# Altium schematic sheet Micro Controller.SchDoc
size A4; SheetNumber: 4; SheetTotal: 6; ProjectTitle: DSP_VERSION_1.0
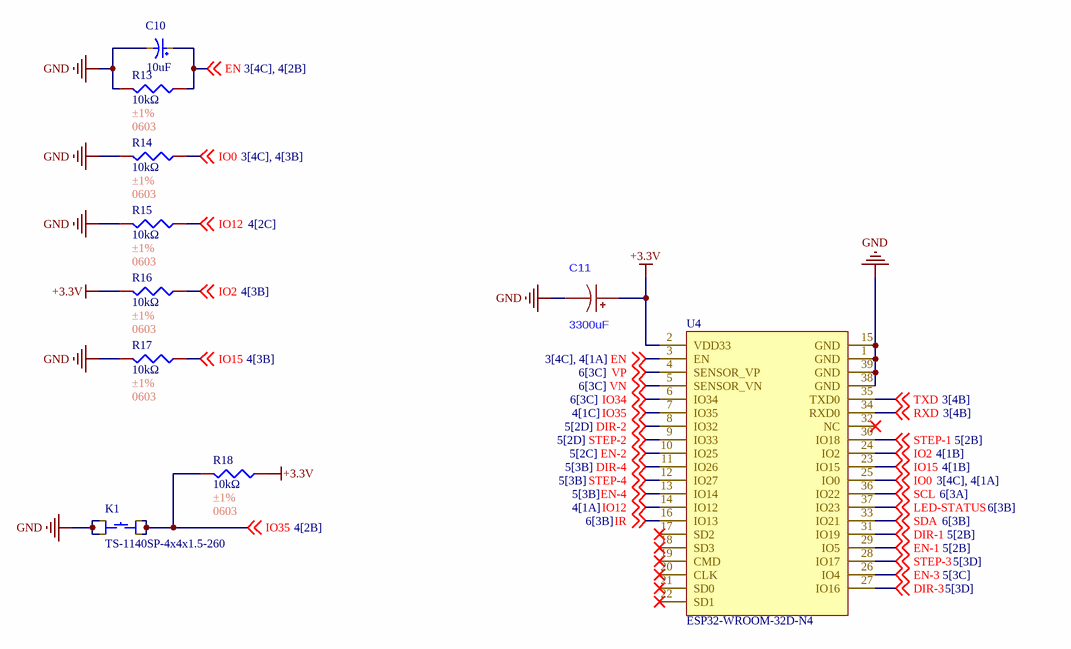
[diagram p0: Micro Controller.SchDoc]

## Parts
C10  10uF  [C_TH_5x11mm]
C11  3300uF  [Through Hole,D8xL16mm]
K1  TS-1140SP-4x4x1.5-260  [4x4x1.5]
R13  10kΩ  Tolerance: ±1%  Package: 0603  [R0603]
R14  10kΩ  Tolerance: ±1%  Package: 0603  [R0603]
R15  10kΩ  Tolerance: ±1%  Package: 0603  [R0603]
R16  10kΩ  Tolerance: ±1%  Package: 0603  [R0603]
R17  10kΩ  Tolerance: ±1%  Package: 0603  [R0603]
R18  10kΩ  Tolerance: ±1%  Package: 0603  [R0603]
U4  ESP32-WROOM-32D-N4  [ESP32-WROOM-32D-N4]

## Nets
+3.3V: C11.1 R16.2 R18.1 U4.2(VDD33)
GND: C10.2 C11.2 K1.1 K1.3 R13.2 R14.2 R15.2 R17.2 U4.1(GND) U4.15(GND) U4.38(GND) U4.39(GND)
DIR-1: U4.31(IO19) ; off-sheet DIR-1
DIR-2: U4.8(IO32) ; off-sheet DIR-2
DIR-3: U4.27(IO16) ; off-sheet DIR-3
DIR-4: U4.11(IO26) ; off-sheet DIR-4
EN: C10.1 R13.1 U4.3(EN) ; off-sheet EN
EN-1: U4.29(IO5) ; off-sheet EN-1
EN-2: U4.10(IO25) ; off-sheet EN-2
EN-3: U4.26(IO4) ; off-sheet EN-3
EN-4: U4.13(IO14) ; off-sheet EN-4
IO0: R14.1 U4.25(IO0) ; off-sheet IO0
IO2: R16.1 U4.24(IO2) ; off-sheet IO2
IO12: R15.1 U4.14(IO12) ; off-sheet IO12
IO15: R17.1 U4.23(IO15) ; off-sheet IO15
IO34: U4.6(IO34) ; off-sheet IO34
IO35: K1.2 K1.4 R18.2 U4.7(IO35) ; off-sheet IO35
IR: U4.16(IO13) ; off-sheet IR
LED-STATUS: U4.37(IO23) ; off-sheet LED-STATUS
RXD: U4.34(RXD0) ; off-sheet RXD
SCL: U4.36(IO22) ; off-sheet SCL
SDA: U4.33(IO21) ; off-sheet SDA
STEP-1: U4.30(IO18) ; off-sheet STEP-1
STEP-2: U4.9(IO33) ; off-sheet STEP-2
STEP-3: U4.28(IO17) ; off-sheet STEP-3
STEP-4: U4.12(IO27) ; off-sheet STEP-4
TXD: U4.35(TXD0) ; off-sheet TXD
VN: U4.5(SENSOR_VN) ; off-sheet VN
VP: U4.4(SENSOR_VP) ; off-sheet VP

Not connected (* = marked no-connect by the designer): U4 17(SD2)* 18(SD3)* 19(CMD)* 20(CLK)* 21(SD0)* 22(SD1)* 32(NC)*

## Notes on the sheet
- Author:
- Title:
- Size:
- A4
- Project:
- Approved:
- Revision:
- Modified Date:
- CONFIDENTIAL
- Date:
- SW Version:

## Library data of the parts
C10 = C_10uF_5x11TH: 10uF 50V ±20% Through Hole,D5xL11mm Aluminum Electrolytic Capacitors - Leaded ROHS; Manufacturer: Rubycon; Mfr. Part #: 50YXF10MEFC5X11; Key Attributes: CAP ALUM 10uF ±20% 50V TH; Pin Spacing: 2mm; LCSC Part #: C88726; Package: Through Hole,D5xL11mm; Tolerance: ±20%; Voltage Rating: 50V; Capacitance: 10uF; Link: https://www.lcsc.com/product-detail/C88726.html?s_z=n_electrolytic%252010uF
C11 = Through Hole,D8xL16mm: 3300uF ±20% 6.3V Through Hole,D8xL16mm 2000hrs; Manufacturer: Honor Elec; Mfr. Part #: HS0J338M0816PC; Key Attributes: CAP ALUM POLY 3300uF ±20% 6.3V TH; LCSC Part #: C5438512; Package: Through Hole,D8xL16mm; Link: https://www.lcsc.com/product-detail/C5438512.html
K1 = TS-1140SP-4x4x1.5-260: SMD Tactile Switches ROHS; Manufacturer: CAX; Mfr. Part #: TS-1140SP-4x4x1.5-260; LCSC Part #: C49023394; Package: SMD; Link: https://www.lcsc.com/product-detail/C49023394.html?s_z=n_button%25204x4
R13-R18 = R0603_10kΩ_±1%: 62.5mW Thick Film Resistor 50V ±1% ±200ppm/℃ 10Ω 0402 Chip Resistor - Surface Mount ROHS; Manufacturer: YAGEO; Mfr. Part #: RC0402FR-0710RL; LCSC Part #: C138066; Resistance: 10kΩ; Link: https://www.lcsc.com/product-detail/C138066.html?s_z=n_resistor%25200402%252010R
U4 = ESPRESSIF ESP32-WROOM-32D-N4: SMD,18x25.5mm WiFi Modules ROHS; Manufacturer: ESPRESSIF; Mfr. Part #: ESP32-WROOM-32D-N4; LCSC Part #: C473012; Package: SMD,18x25.5mm; Link: https://www.lcsc.com/product-detail/C473012.html?s_z=n_esp32-wroom-32d